# Altium schematic sheet 1_P1.schdoc
size 429 x 307 mm; Symbol: Drawing-Symbol_A4; Device: Drawing-Symbol_A4; @Project Name: rocky; @Page Count: 1; @Update Date: 2026-06-12; @Create Date: 2026-06-08; @Schematic Name: Schematic1; @Page No: 1; @Page Name: P1; Company: EasyEDA.com; Version: V1.0; Page Size: A4; @Create Time: 13:48:42; @Update Time: 19:53:57; Width: 1655; Height: 1170; Region Start: 1; X Region Count: 6; Y Region Count: 4; Blade Width: 10; Title Block Position: 3; @Board Name: Board1
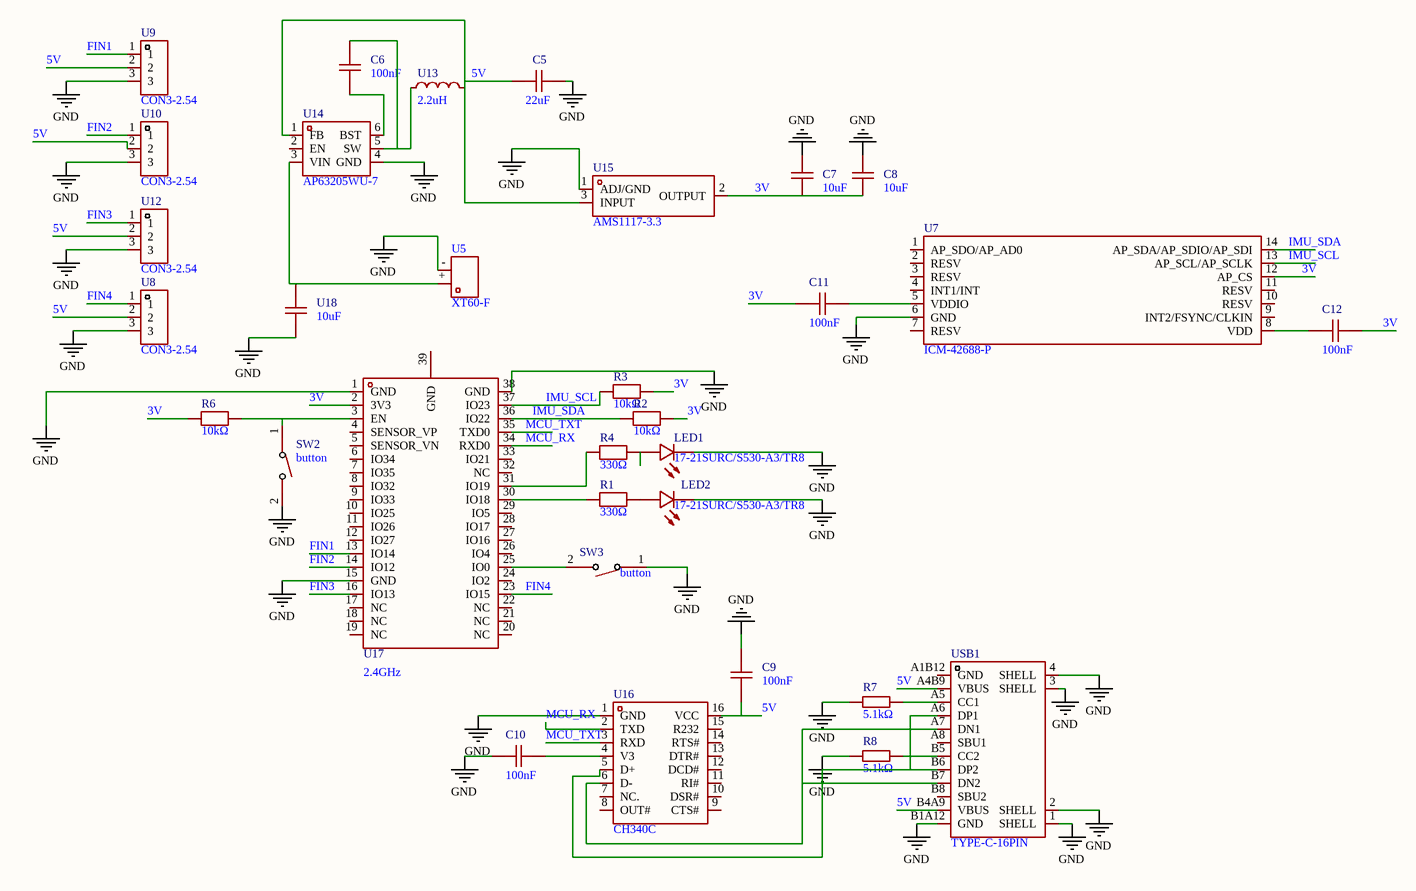
[diagram p0: 1_P1.schdoc]

## Parts
C5  22uF  [C0805]
C6  100nF  [C0402]
C7  10uF  [C0805]
C8  10uF  [C0805]
C9  100nF  [C0402]
C10  100nF  [C0402]
C11  100nF  [C0402]
C12  100nF  [C0402]
LED1  17-21SURC/S530-A3/TR8  [LED0805-R-RD]
LED2  17-21SURC/S530-A3/TR8  [LED0805-R-RD]
R1  330Ω  [R0805]
R2  10kΩ  [R0805]
R3  10kΩ  [R0805]
R4  330Ω  [R0805]
R6  10kΩ  [R0805]
R7  5.1kΩ  [R0805]
R8  5.1kΩ  [R0805]
SW2  button  [SW-SMD_L3.9-W3.0-P4.45]
SW3  button  [SW-SMD_L3.9-W3.0-P4.45]
U5  XT60-F  [CONN-TH_XT60PB-F]
U7  ICM-42688-P  [LGA-14_L3.0-W2.5-P0.50-TL]
U8  CON3-2.54  [HDR-TH_3P-P2.54-V-M-1]
U9  CON3-2.54  [HDR-TH_3P-P2.54-V-M-1]
U10  CON3-2.54  [HDR-TH_3P-P2.54-V-M-1]
U12  CON3-2.54  [HDR-TH_3P-P2.54-V-M-1]
U13  2.2uH  [IND-SMD_L4.5-W4.0_SLF0403-1]
U14  AP63205WU-7  [TSOT-23-6_L2.9-W1.6-P0.95-LS2.8-BL]
U15  AMS1117-3.3  [TO-252-2_L6.6-W5.6-P2.3-LS9.7]
U16  CH340C  [SOP-16_L10.0-W3.9-P1.27-LS6.0-BL]
U17  2.4GHz  [WIFI-SMD_ESP32-WROOM-32E]
U18  10uF  [C0805]
USB1  TYPE-C-16PIN  [USB-C-SMD_TYPE-C16PIN-SHOUHAN]

## Nets
GND: C5.1 C7.2 C8.2 C9.2 C10.2 LED1.2(C) LED2.2(C) R7.1 R8.1 SW2.2 SW3.1 U5.- U7.6(GND) U8.3 U9.3 U10.3 U12.3 U14.4(GND) U15.1(ADJ/GND) U16.1(GND) U17.1(GND) U17.15(GND) U17.38(GND) U18.1 USB1.1(SHELL) USB1.2(SHELL) USB1.3(SHELL) USB1.4(SHELL) USB1.B1A12(GND)
3V: C7.1 C8.1 C11.2 C12.1 R2.2 R3.2 R6.1 U7.12(AP_CS) U15.2(OUTPUT) U17.2(3V3)
5V: C5.2 C9.1 U8.2 U9.2 U10.2 U12.2 U13.2 U14.1(FB) U15.3(INPUT) U16.16(VCC) USB1.A4B9(VBUS) USB1.B4A9(VBUS)
FIN1: U9.1 U17.13(IO14)
FIN2: U10.1 U17.14(IO12)
FIN3: U12.1 U17.16(IO13)
FIN4: U8.1 U17.23(IO15)
IMU_SCL: R3.1 U7.13(AP_SCL/AP_SCLK) U17.37(IO23)
IMU_SDA: R2.1 U7.14(AP_SDA/AP_SDIO/AP_SDI) U17.36(IO22)
MCU_RX: U16.2(TXD) U17.34(RXD0)
MCU_TXT: U16.3(RXD) U17.35(TXD0)
NetC6_1: C6.1 U13.1 U14.5(SW)
NetC6_2: C6.2 U14.6(BST)
NetC10_1: C10.1 U16.4(V3)
NetC11_1: C11.1 U7.5(VDDIO)
NetC12_2: C12.2 U7.8(VDD)
NetLED1_1: LED1.1(A) R4.2
NetLED2_1: LED2.1(A) R1.2
NetR1_1: R1.1 U17.30(IO18)
NetR4_1: R4.1 U17.31(IO19)
NetR6_2: R6.2 SW2.1 U17.3(EN)
NetR7_2: R7.2 USB1.A5(CC1)
NetR8_2: R8.2 USB1.B5(CC2)
NetSW3_2: SW3.2 U17.25(IO0)
NetU5_+: U5.+ U14.3(VIN) U18.2
NetU16_5: U16.5(D+) USB1.A6(DP1) USB1.B6(DP2)
NetU16_6: U16.6(D-) USB1.A7(DN1) USB1.B7(DN2)

Not connected (* = marked no-connect by the designer): U7 1(AP_SDO/AP_AD0) 2(RESV) 3(RESV) 4(INT1/INT) 7(RESV) 9(INT2/FSYNC/CLKIN) 10(RESV) 11(RESV); U14 2(EN); U16 7(NC.) 8(OUT#) 9(CTS#) 10(DSR#) 11(RI#) 12(DCD#) 13(DTR#) 14(RTS#) 15(R232); U17 4(SENSOR_VP) 5(SENSOR_VN) 6(IO34) 7(IO35) 8(IO32) 9(IO33) 10(IO25) 11(IO26) 12(IO27) 17(NC) 18(NC) 19(NC) 20(NC) 21(NC) 22(NC) 24(IO2) 26(IO4) 27(IO16) 28(IO17) 29(IO5) 32(NC) 33(IO21) 39(GND); USB1 A1B12(GND) A8(SBU1) B8(SBU2)

## Notes on the sheet
- 1
- 2
- 3
- 4
- 5
- 6
- A
- B
- C
- Schematic
- Schematic1
- Create at
- Update at
- 2026-06-08
- 2026-06-12
- D
- Board
- Drawn
- Board1
- Page
- P1
- Reviewed
- Version
- Size
- rocky
- Page  1  Total  1
- V1.0
- A4
- EasyEDA.com

## Library data of the parts
C5 = 0805X226M160NT: Manufacturer: FH(风华); Add into BOM: yes; Tolerance: ±20%; Voltage Rating: 16V; Temperature Coefficient: X5R; Symbol: 0805X226M160NT; Device: 0805X226M160NT; LCSC Part Name: 22uF ±20% 16V; Supplier Part: C129302; Manufacturer Part: 0805X226M160NT; Supplier Footprint: 0805; JLCPCB Part Class: Extended Part; Datasheet: https://item.szlcsc.com/datasheet/0805X226M160NT/140588.html; Supplier: LCSC; Convert to PCB: yes; Value: 22uF
C6 C9-C12 = C0402X7R160-104MNE: Manufacturer: Venkel; Add into BOM: yes; Tolerance: ±20%; Voltage Rating: 16V; Temperature Coefficient: X7R; Symbol: C0402X7R160-104MNE; Device: C0402X7R160-104MNE; LCSC Part Name: 100nF ±20% 16V; Supplier Part: C3839219; Manufacturer Part: C0402X7R160-104MNE; Supplier Footprint: 0402; JLCPCB Part Class: Extended Part; Datasheet: https://item.szlcsc.com/datasheet/C0402X7R160-104MNE/4407702.html; Supplier: LCSC; Convert to PCB: yes; Value: 100nF
C7 C8 = 0805F106M100: Manufacturer: Walsin(华新科); Add into BOM: yes; Tolerance: ±20%; Voltage Rating: 10V; Temperature Coefficient: Y5V; Symbol: 0805F106M100; Device: 0805F106M100; LCSC Part Name: 停产 10uF ±20% 10V; Supplier Part: C105506; Manufacturer Part: 0805F106M100; Supplier Footprint: 0805; JLCPCB Part Class: Extended Part; Datasheet: https://item.szlcsc.com/datasheet/0805F106M100/106721.html; Supplier: LCSC; Convert to PCB: yes; Value: 10uF
LED1 LED2 = 17-21SURC/S530-A3/TR8: Manufacturer: EVERLIGHT(亿光); Add into BOM: yes; Illumination Color: Orange Red; Voltage - Forward(Vf): 2V; Power(Watts): 60mW; Forward Current: 20mA; Wavelength - Dominant: 624nm; Peak Wavelength: 632nm; Lens Color: Water Clear; Luminous Intensity: 41mcd~61mcd; Viewing Angle: 140°; Symbol: 17-21SURC/S530-A3/TR8; Device: 17-21SURC/S530-A3/TR8; LCSC Part Name: 17-21SURC/S530-A3/TR8 停产; Supplier Part: C72037; Manufacturer Part: 17-21SURC/S530-A3/TR8; Supplier Footprint: 0805; JLCPCB Part Class: Extended Part; Supplier: LCSC; Convert to PCB: yes; Lamp Holder Type: -; Diode Configuration: -; Color Temperature: -; Mounting Style: -; Operating Temperature: -40℃~+85℃
R1 R4 = FRC0805J331 TS: Manufacturer: FOJAN(富捷); Add into BOM: yes; Tolerance: ±5%; Power(Watts): 125mW; Voltage-Supply(Max): 150V; Temperature Coefficient: ±100ppm/℃; Symbol: FRC0805J331 TS; Device: FRC0805J331 TS; LCSC Part Name: 330Ω ±5% 125mW 厚膜电阻; Supplier Part: C2907321; Manufacturer Part: FRC0805J331 TS; Supplier Footprint: 0805; JLCPCB Part Class: Extended Part; Supplier: LCSC; Convert to PCB: yes; Type: Thick Film Resistor; Value: 330Ω; Operating Temperature: -55℃~+155℃
R2 R3 R6 = FRC0805J103TS: Manufacturer: FOJAN(富捷); Add into BOM: yes; Tolerance: ±5%; Power(Watts): 125mW; Voltage-Supply(Max): 150V; Temperature Coefficient: ±100ppm/℃; Symbol: FRC0805J103TS; Device: FRC0805J103TS; LCSC Part Name: 10kΩ ±5% 125mW 厚膜电阻; Supplier Part: C2930231; Manufacturer Part: FRC0805J103TS; Supplier Footprint: 0805; JLCPCB Part Class: Extended Part; Supplier: LCSC; Convert to PCB: yes; Type: Thick Film Resistor; Value: 10kΩ; Operating Temperature: -55℃~+155℃
R7 R8 = 0805W8F5101T5E: Manufacturer: UNI-ROYAL(厚声); Add into BOM: yes; Tolerance: ±1%; Power(Watts): 125mW; Voltage-Supply(Max): 150V; Temperature Coefficient: ±100ppm/℃; Symbol: 0805W8F5101T5E; Device: 0805W8F5101T5E; LCSC Part Name: 5.1kΩ ±1% 125mW 厚膜电阻; Supplier Part: C27834; Manufacturer Part: 0805W8F5101T5E; Supplier Footprint: 0805; JLCPCB Part Class: Basic Part; Datasheet: https://item.szlcsc.com/datasheet/0805W8F5101T5E/28584.html; Supplier: LCSC; Convert to PCB: yes; Type: Thick Film Resistor; Value: 5.1kΩ; Operating Temperature: -55℃~+155℃
SW2 SW3 = TS-1088-AR02016: Manufacturer: XUNPU(讯普); Add into BOM: yes; Circuit: SPST; Actuator Style: Round Button; Operating Force: 1.6N; Switch Height: 2mm; with Bracket: Without Bracket; Contact Current: 50mA; Voltage Rating: 12V; Actuator/Cap Color: Black; Life: 100,000 Cycles; Symbol: TS-1088-AR02016; Device: TS-1088-AR02016; LCSC Part Name: 4*3*2mm 立贴 轻触开关; Supplier Part: C720477; Manufacturer Part: button; Supplier Footprint: SMD,4x3mm; JLCPCB Part Class: Basic Part; Datasheet: https://item.szlcsc.com/datasheet/TS-1088-AR02016/763484.html; Supplier: LCSC; Convert to PCB: yes; Mounting Type: Surface Mount,Vertical; Length: 4mm; Width: 3mm; Termination Style: SMD(SMT) Tab; Operating Temperature: -30℃~+80℃
U5 = XT60-F: Manufacturer: AMASS(艾迈斯); Add into BOM: yes; Connector type: Banana plug; interface form: Female; metal material: Gold plating; Symbol: XT60-F; Device: XT60-F; LCSC Part Name: AMASS(艾迈斯)航模插头 3.5mm镀金香蕉头 母头XT60-F.G.Y; Supplier Part: C98734; Manufacturer Part: XT60-F; Supplier Footprint: -; JLCPCB Part Class: Extended Part; Datasheet: https://item.szlcsc.com/datasheet/XT60-F/99944.html; Supplier: LCSC; Convert to PCB: yes; colour: Yellow
U7 = ICM-42688-P: Manufacturer: TDK InvenSense(应美盛); Add into BOM: yes; Accelerometer Sensing Axis: X,Y,Z; Acceleration Measurement Range (MAX): ±16g; Gyroscope Measurement Range (MAX): ±2000dps; Sensor Type: IMU (accelerometer + gyroscope); Output Bits: 16bit; Interface: I2C；SPI; Voltage - Supply: 1.71V~3.6V; Cache Size: 2KB; Standby Current: 7.5uA; Symbol: ICM-42688-P; Device: ICM-42688-P; LCSC Part Name: 高精度六轴MEMS运动跟踪器件; Supplier Part: C1850418; Manufacturer Part: ICM-42688-P; Supplier Footprint: LGA-14(2.5x3); JLCPCB Part Class: Extended Part; Datasheet: https://item.szlcsc.com/datasheet/ICM-42688-P/1941231.html; Supplier: LCSC; Convert to PCB: yes; Gyroscope Sensing Axis: X,Y,Z; Operating Temperature: -40℃~+85℃; Features: Motion event detection；Synchronization and timestamp
U8-U10 U12 = CON3-2.54: Symbol: CON3-2.54_C9900003715; Add into BOM: yes; Device: CON3-2.54; LCSC Part Name: CON3-2.54; Supplier Part: C9900003715; Manufacturer Part: CON3-2.54; Supplier Footprint: HDR-TH_40P-P2.54-V-M-L101.6-W2.5; JLCPCB Part Class: Extended Part; Supplier: LCSC; Convert to PCB: yes
U13 = CY43-2.2UH: Manufacturer: SHOU HAN(首韩); Add into BOM: yes; Tolerance: ±20%; Current Rating: 2.3A; DC Resistance(DCR): 42mΩ; Symbol: CY43-2.2UH; Device: CY43-2.2UH; LCSC Part Name: 2.2uH ±20%; Supplier Part: C2929416; Manufacturer Part: CY43-2.2UH; Supplier Footprint: SMD,4.5x4mm; JLCPCB Part Class: Extended Part; Datasheet: https://item.szlcsc.com/datasheet/CY43-2.2UH/3264898.html; Supplier: LCSC; Convert to PCB: yes; Value: 2.2uH; Current - Saturation (Isat): -; Q @ Frequency: -; Frequency - Self Resonant: -; Ratings: -
U14 = AP63205WU-7: Manufacturer: DIODES(美台); Add into BOM: yes; Function: Step-down type; Voltage - Supply: 3.8V~32V; Output Voltage: 5V; Output Current: 2A; Frequency - Switching: 1.1MHz; Number of Outputs: 1; Topology: Buck; Quiescent Current: 22uA; Switch tube (built-in/external): Built-in; Output Type: Fixed; Symbol: AP63205WU-7; Device: AP63205WU-7; LCSC Part Name: 降压型 2A 3.8V~32V; Supplier Part: C2071056; Manufacturer Part: AP63205WU-7; Supplier Footprint: TSOT-23-6; JLCPCB Part Class: Extended Part; Datasheet: https://item.szlcsc.com/datasheet/AP63205WU-7/2162639.html; Supplier: LCSC; Convert to PCB: yes; Operating Temperature: -40℃~+85℃@(TA); Synchronous Rectifier: Yes; Features: Light load efficient mode；Cycle-by-cycle current limiting；Overcurrent Protection；EMI optimization (spread spectrum)；Hiccup current limiting
U15 = AMS1117-3.3_C41414107: Manufacturer: YONGYUTAI(永裕泰); Add into BOM: yes; Output Type: Fixed; Voltage - Supply: 15V; Output Voltage: 3.3V; Output Current: 800mA; Power Supply Rejection Ratio (PSRR): 75dB@(120Hz); Voltage Dropout: 1.25V@(1A); Noise: 0.003%Vout; Output Configuration: Positive; Number of Outputs: 1; Symbol: AMS1117-3.3_C41414107; Device: AMS1117-3.3_C41414107; LCSC Part Name: AMS1117-3.3; Supplier Part: C41414107; Manufacturer Part: AMS1117-3.3; Supplier Footprint: TO-252; JLCPCB Part Class: Extended Part; Datasheet: https://item.szlcsc.com/datasheet/AMS1117-3.3/43231650.html; Supplier: LCSC; Convert to PCB: yes; standby current: -; Features: Over Current Protection；Over Temperature Protection; Operating Temperature: -40℃~+125℃@(TJ)
U16 = CH340C: Manufacturer: WCH(南京沁恒); Add into BOM: yes; Applications Function: Transceiver; USB Protocol: USB 2.0; Voltage - Supply: 3.3V；5V; Data Rate: 2Mbps; Current - Supply: 7mA; Supply Current (Iq): 50uA; Symbol: CH340C; Device: CH340C; LCSC Part Name: USB转串口芯片; Supplier Part: C84681; Manufacturer Part: CH340C; Supplier Footprint: SOP-16; JLCPCB Part Class: Extended Part; Datasheet: https://item.szlcsc.com/datasheet/CH340C/85852.html; Supplier: LCSC; Convert to PCB: yes; Operating Temperature: -20℃~+70℃
U17 = ESP32-WROOM-32E-N8: Manufacturer: ESPRESSIF(乐鑫); Utilized IC / Part: ESP32-DOWD-V3; Symbol: ESP32-WROOM-32E(8MB); Add into BOM: yes; Wireless Standard: Bluetooth4.2; Interface Type: I2C；GPIO；UART；SPI；PWM；SDIO；I2S; Antenna Type: On-board PCB Antenna; Output Power: 20dBm; Voltage - Supply: 3V~3.6V; Receive  Current: 112mA; Send  Current: 239mA; Sensitivity: -98dBm; Device: ESP32-WROOM-32E-N8; LCSC Part Name: 不带固件 通用型Wi-Fi+BT+BLE MCU模组; Supplier Part: C701342; Manufacturer Part: ESP32-WROOM-32E-N8; Supplier Footprint: SMD,25.5x18mm; JLCPCB Part Class: Extended Part; Datasheet: https://item.szlcsc.com/datasheet/ESP32-WROOM-32E-N8/736350.html; Supplier: LCSC; Convert to PCB: yes; Value: 2.4GHz; Operating Temperature: -40℃~+85℃
U18 = HGC0805R5106K350NSLJ: Manufacturer: Chinocera(华瓷); Add into BOM: yes; Tolerance: ±10%; Voltage Rating: 35V; Temperature Coefficient: X5R; Symbol: HGC0805R5106K350NSLJ; Device: HGC0805R5106K350NSLJ; LCSC Part Name: 10uF ±10% 35V; Supplier Part: C33546007; Manufacturer Part: HGC0805R5106K350NSLJ; Supplier Footprint: 0805; JLCPCB Part Class: Extended Part; Datasheet: https://item.szlcsc.com/datasheet/HGC0805R5106K350NSLJ/35278485.html; Supplier: LCSC; Convert to PCB: yes; Value: 10uF
USB1 = TYPE-C-16PIN_C53207801: Manufacturer: JXTCONN(聚兴泰); Add into BOM: yes; Connector Type: Type-C; Gender: Female; Number of Contacts: 16P; Number of Ports: 1; Current Rating-Power: 3A; Voltage Rating: 20V; Connect-Disconnect Life: 10000 times; Detection color: Black; Symbol: TYPE-C-16PIN_C53207801; Device: TYPE-C-16PIN_C53207801; LCSC Part Name: Type-C 母 卧贴; Supplier Part: C53207801; Manufacturer Part: TYPE-C-16PIN; Supplier Footprint: SMD; JLCPCB Part Class: Extended Part; Datasheet: https://item.szlcsc.com/datasheet/TYPE-C-16PIN/56243866.html; Supplier: LCSC; Convert to PCB: yes; Protocol Standard: -; Mounting Type: Surface Mount, Right Angle; Length: 7.35mm; Operating Temperature: -40℃~+85℃